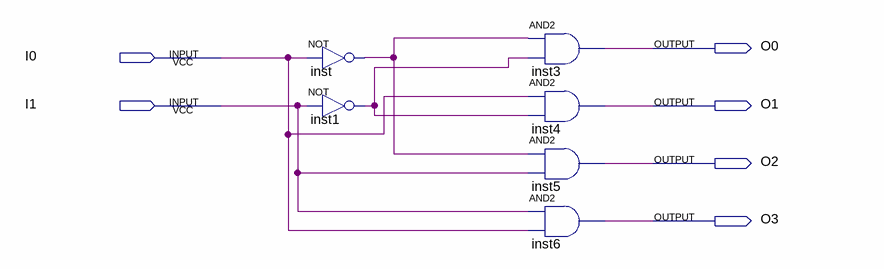
[diagram p0: schematic sheet]
// Quartus schematic decoder_2x4.bdf as structural Verilog: 6 symbols, 6 pins
module decoder_2x4 (
  input  I0,
  input  I1,
  output O0,
  output O1,
  output O2,
  output O3
);

  wire inst1_out, inst_out;

  not inst (inst_out, I0);
  not inst1 (inst1_out, I1);
  and inst3 (O0, inst_out, inst1_out);
  and inst4 (O1, I0, inst1_out);
  and inst5 (O2, inst_out, I1);
  and inst6 (O3, I1, I0);
endmodule
